# Altium schematic sheet External Connections.SchDoc
size A; SheetNumber: 3; SheetTotal: 4
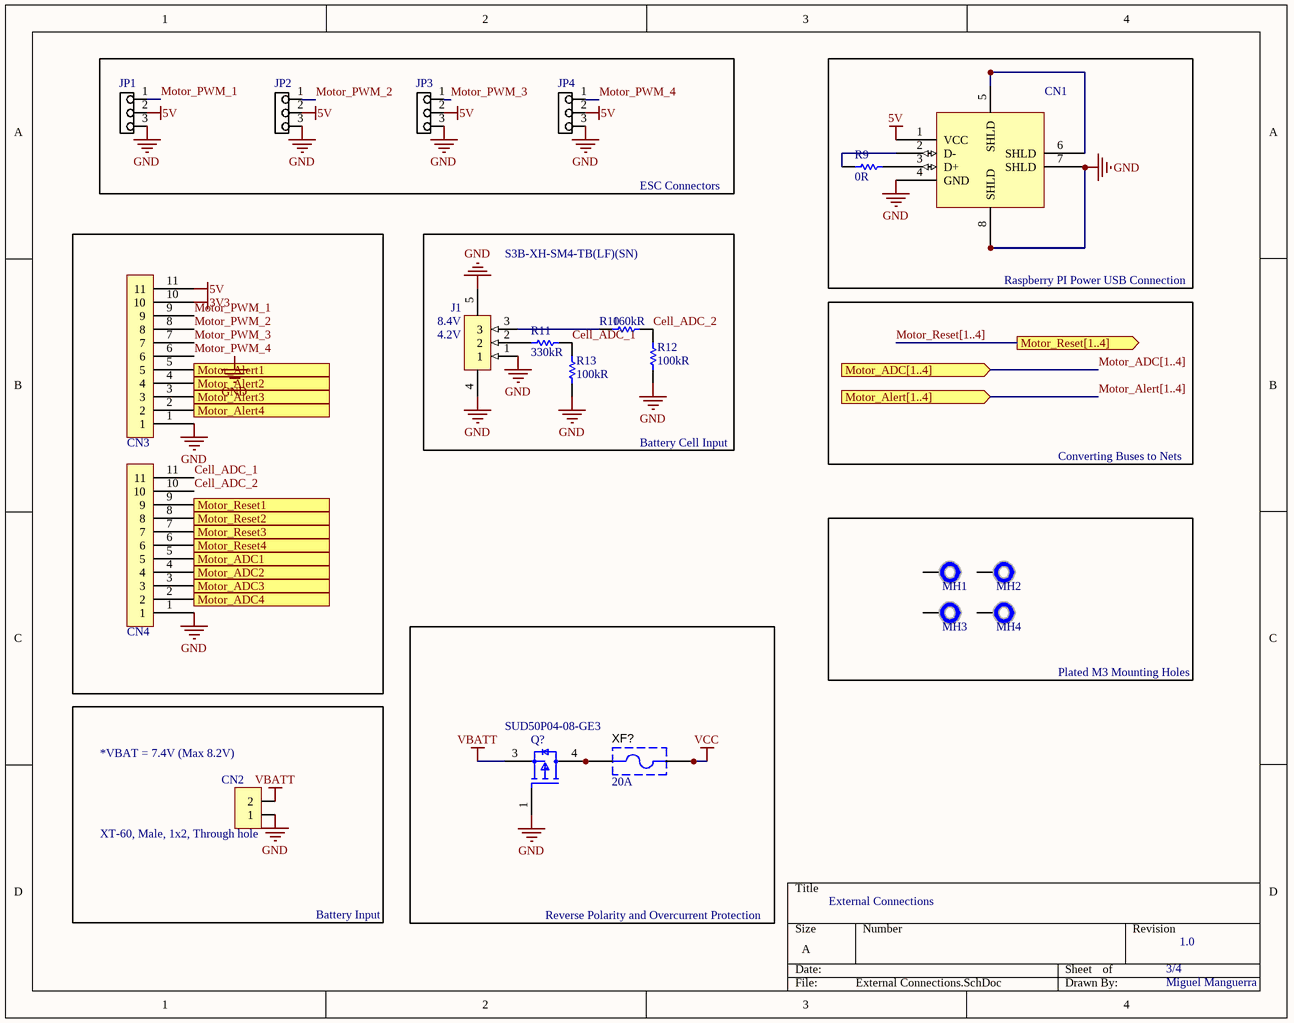
[diagram p0: External Connections.SchDoc]

## Parts
CN1  USB - Type A Female  [USB - Type A Female-Footprint-1]  (value not drawn)
CN2  XT-60, Male, 1x2, Through hole  [XT-60 Male]  (no BOM)
CN3  PH1-11-UA  [PH1-11-UA-Footprint-1]  (value not drawn)
CN4  PH1-11-UA  [PH1-11-UA-Footprint-1]  (value not drawn)
J1  S3B-XH-SM4-TB(LF)(SN)  [New footprint 1]
JP1  1x3 Male Jumper  [Header, Male, 1x3, Pitch: 0.1" (2.54mm),THT]  (value not drawn)
JP2  1x3 Male Jumper  [Header, Male, 1x3, Pitch: 0.1" (2.54mm),THT]  (value not drawn)
JP3  1x3 Male Jumper  [Header, Male, 1x3, Pitch: 0.1" (2.54mm),THT]  (value not drawn)
JP4  1x3 Male Jumper  [Header, Male, 1x3, Pitch: 0.1" (2.54mm),THT]  (value not drawn)
MH1  Mounting Hole, M3, Plated  [Clearance_M3_PLATED]  (value not drawn)  (no BOM)
MH2  Mounting Hole, M3, Plated  [Clearance_M3_PLATED]  (value not drawn)  (no BOM)
MH3  Mounting Hole, M3, Plated  [Clearance_M3_PLATED]  (value not drawn)  (no BOM)
MH4  Mounting Hole, M3, Plated  [Clearance_M3_PLATED]  (value not drawn)  (no BOM)
Q?  SUD50P04-08-GE3  [FP-T16-0236-MFG]
R9  value 0R  [RESC1608N(0603")]  (hidden comment: 0R, 1%, 1/10W, 0603 SMD)
R10  Resistance: 160kR  [RESC0603(1608)_M]  (hidden comment: RC0603FR-07160KL)
R11  Resistance: 330kR  [RESC0603(1608)_M]  (hidden comment: RMCF0603FT330K)
R12  Resistance: 100kR  [RESC1609X50X30ML10T20]  (hidden comment: CRCW0603-100KFKEA)
R13  Resistance: 100kR  [RESC1609X50X30ML10T20]  (hidden comment: CRCW0603-100KFKEA)
XF?  Current Rating: 20A  [KSTN-3557-2]  (hidden comment: 3557-2)

## Blocks framed on the sheet
ESC Connectors: JP1-JP4
Raspberry PI Power USB Connection: CN1 R9
Plated M3 Mounting Holes: MH1-MH4
Reverse Polarity and Overcurrent Protection: Q? XF?

## Ports
Motor_ADC1 (in), Motor_ADC2 (in), Motor_ADC3 (in), Motor_ADC4 (in), Motor_ADC[1..4] (in), Motor_Alert1 (in), Motor_Alert2 (in), Motor_Alert3 (in), Motor_Alert4 (in), Motor_Alert[1..4] (in), Motor_Reset1 (out), Motor_Reset2 (out), Motor_Reset3 (out), Motor_Reset4 (out), Motor_Reset[1..4] (out)

## Nets
3V3: CN3.10
5V: CN1.1(VCC) CN3.11 JP1.2 JP2.2 JP3.2 JP4.2
GND: CN1.4(GND) CN1.7(SHLD) CN1.8(SHLD) CN2.1 CN3.1 CN4.1 J1.1 J1.4 J1.5 JP1.3 JP2.3 JP3.3 JP4.3 Q?.1(G) R12.1 R13.1
VBATT: CN2.2 Q?.3(S)
VCC: XF?.3 XF?.4
Cell_ADC_1: CN4.11 R11.1 R13.2
Cell_ADC_2: CN4.10 R10.2 R12.2
Motor_ADC1: CN4.5 ; port Motor_ADC1
Motor_ADC2: CN4.4 ; port Motor_ADC2
Motor_ADC3: CN4.3 ; port Motor_ADC3
Motor_ADC4: CN4.2 ; port Motor_ADC4
Motor_Alert1: CN3.5 ; port Motor_Alert1
Motor_Alert2: CN3.4 ; port Motor_Alert2
Motor_Alert3: CN3.3 ; port Motor_Alert3
Motor_Alert4: CN3.2 ; port Motor_Alert4
Motor_PWM_1: CN3.9 JP1.1
Motor_PWM_2: CN3.8 JP2.1
Motor_PWM_3: CN3.7 JP3.1
Motor_PWM_4: CN3.6 JP4.1
Motor_Reset1: CN4.9 ; port Motor_Reset1
Motor_Reset2: CN4.8 ; port Motor_Reset2
Motor_Reset3: CN4.7 ; port Motor_Reset3
Motor_Reset4: CN4.6 ; port Motor_Reset4
NetCN1_2: CN1.2(D-) R9.1
NetCN1_3: CN1.3(D+) R9.2
NetCN1_5: CN1.5(SHLD) CN1.6(SHLD)
NetJ1_2: J1.2 R11.2
NetJ1_3: J1.3 R10.1
NetQ?_4: Q?.4(D) XF?.1 XF?.2

Not connected (* = marked no-connect by the designer): MH1 1; MH2 1; MH3 1; MH4 1

## Buses and harness runs
bus Motor_ADC[1..4] = port Motor_ADC[1..4]
bus Motor_Alert[1..4] = port Motor_Alert[1..4]
bus Motor_Reset[1..4] = port Motor_Reset[1..4]

## Notes on the sheet
- (near J1) 8.4V
- (near J1) 4.2V
- Battery Cell Input
- Converting Buses to Nets
- (near CN2) *VBAT = 7.4V (Max 8.2V)
- External Connections
- Battery Input
- 3/4
- 1.0
- Miguel Manguerra
- Labels drawn without touching a wire or pin: GND

## Library data of the parts
CN1 = CMP-00116-2: USB - Type A Female USB 2.0 THT; LCSC Part #: C168725; Created By: Miguel Manguerra
CN2 = CMP-005-0041-1: Date Published: 2016-09-08; Pin Count: 2; Source: AUVic_Schematic_Library_Connectors.SchLib; Component Type: Standard (No BOM); Design Item ID: XT-60, Male, 1x2, Through hole; Publisher: Andy Bates
CN3 CN4 = CMP-00135-1: Connector Header Through Hole 11 position 0.100" (2.54mm)
J1 = CMP-00132-1: JST (JAPAN SOLDERLESS TERMINALS) - S3B-XH-SM4-TB(LF)(SN) - Wire-To-Board Connector, XH Series, Surface Mount, Header, 3, 2.5 mm, Tin Plated Contacts RoHS Compliant: Yes; Number of Positions: 3; Pitch: 2.5mm; Contact Resistance: 20mR; Connector Type: Male Pin; Max Voltage Rating (AC): 250V; Max Current Rating: 3A; Gender: Male; Packaging: Tape and Reel; Number of Rows: 1; Length: 12.5mm; Number of Contacts: 3; Lead Free: Lead Free; Mount: Surface Mount; Contact Type: Male Pin; Color: Natural; Contact Plating: Tin,Copper; Package Quantity: 1; Max Operating Temperature: 85°C; REACH SVHC: No SVHC; Min Operating Temperature: -25°C; Orientation: Right Angle; Housing Material: Polyamide; Termination: Solder; Contact Material: Copper Alloy,Brass; Series: XH; Depth: 10mm; Housing Color: Beige; Fastening Type: Detent
JP1-JP4 = CMP-004-0002-1: Made By: Poorna Chander Kalidas; Component Type: Standard; Design Item ID: 1x3 Male Jumper; Source: AUVic_Schematic_Library_Connectors.SchLib; Pin Count: 3
MH1-MH4 = CMP-053-0000-1: Created By: Ashwin Sira; Pin Count: 1; Publisher: AUVic; Date Created: 2016-06-08; Source: AUVic_Integrated_Library_Virtual_Components.SchLib; Design Item ID: Mounting Hole, M3, Plated; Component Type: Standard (No BOM)
Q? = CMP-02550-000229-1: MOSFET P-CH 40V 50A DPAK; Manufacturer: Vishay; Gate To Source Voltage: 20V; Transconductance: 45S; Gate Charge At Vgs: 106nC @ -10V; Threshold Vgs Max: -2.5V; Continuous Drain Current: -50A; Drain To Source Voltage: -40V; Reverse Recovery Time: 35ns; Max Forward Diode Voltage: -1.5V; Input Capacitace At Vds: 5380pF @ -20V; Number Of Channels: 1; Threshold Vgs Min: -1V; Pulse Drain Current: -100A; Max Junction Temp: +150°C; Drain To Source Resistance: 0.0067Ω; Turn On Delay Time: 15ns; Depletion Mode: False; Turn Off Delay Time: 70ns; Typ Forward Diode Voltage: -0.8V; Reverse Recovery Charge: 33nC; Power Dissipation: 2.5W; Rthja Max: 50°C/W; Digikey Description: MOSFET P-CH 40V 50A DPAK; Category: Trans; Package: T16-0236; Device Class L2: Transistors; Lead Free: Yes; Temperature Range High: +150°C; RoHS: TRUE; Manufacturer Part Number: SUD50P04-08-GE3; Drain To Source Breakdown Voltage: -40V; Temperature Range Low: -55°C; Device Class L1: Discrete Semiconductors; Number Of P Channels: 1; Height: 2.507mm; Device Class L3: MOSFETs; ComponentLink2URL: http://www.vishay.com/docs/65594/sud50p04-08.pdf; ComponentLink2Description: Datasheet; Mouser Description: p-Ch Mosfet Dpak (To-252) 40v 8.1mohm @ 10v; Automotive: No; Octopart: https://octopart.com/sud50p04-08-ge3-vishay-44145278; Temperature: -55°C to +150°C
R9 = CMP-047-0001-1: Made By: Ashwin Sira; Owned By: AUVic; Component Type: Standard; Design Item ID: 0R, 1%, 1/10W, 0603 SMD; Last Edited: 14-05-31; Created On: 14-05-31; Source: AUVic_Schematic_Library_Resistors.SchLib; Pin Count: 2
R10 = CMP-00134-1: RES SMD 160K OHM 1% 1/10W 0603; Voltage Rating: 50V; Temperature Coefficient: 100ppm/°C; Max Power Dissipation: 100mW; Mount: Surface Mount; Resistor Type: Thick Film; Packaging: Tape and Reel; Features: Moisture Resistant; Min Operating Temperature: -55°C; Width: 0.031inch; Size Code: 0603; Series: RC; Tolerance: 1%; Number of Terminations: 2; RoHS Compliant: Yes; Max Operating Temperature: 155°C; Termination: SMD/SMT; Height: 0.022inch; Case/Package: 0603; Package Quantity: 1; Military Standard: Not; Case Code (Imperial): 0603; Power Rating: 100mW; Depth: 0.8mm; Length: 0.063inch; Lead Free: Lead Free; Case Code (Metric): 1608; Construction: Rectangular; Voltage Rating (DC): 50V; Technology: THICK FILM
R11 = CMP-00133-1: RES 330K OHM 1% 1/10W 0603; Max Power Dissipation: 100mW; Temperature Coefficient: 100ppm/°C; Width: 0.031inch; RoHS Compliant: Yes; Tolerance: 1%; Max Operating Temperature: 155°C; Case Code (Metric): 1608; Contact Plating: Tin,Matte; Number of Terminations: 2; Series: RMCF; Features: Automotive AEC-Q200; Length: 0.061inch; Resistor Type: Thick Film; Packaging: Tape and Reel; Min Operating Temperature: -55°C; Case/Package: 0603; Case Code (Imperial): 0603; Height: 0.022inch; Mount: Surface Mount; Radiation Hardening: No
R12 R13 = CMP-00036-2: Resistor; Thick Film; 100 Kilohms; 0.1 W; 1%; SMT; 0603; TCR 37 ppm/DegC; Tape and Reel; Power Rating: 100mW; Voltage Rating (DC): 75V; Temperature Coefficient: 100ppm/°C; Width: 0.033inch; Contact Plating: Tin,Lead; Packaging: Tape and Reel; Termination: SMD/SMT; Number of Pins: 2; Package Quantity: 10; Radiation Hardening: No; Case Code (Imperial): 0603; Military Standard: Not; REACH SVHC: Unknown; Max Power Dissipation: 100mW; Tolerance: 1%; Weight: 7.1E-05oz; Length: 1.55mm; Number of Terminations: 2; Min Operating Temperature: -55°C; Lead Free: Lead Free; Max Operating Temperature: 155°C; Composition: Thick Film; Features: Automotive AEC-Q200; Case Code (Metric): 1608; Case/Package: 0603; Depth: 0.85mm; Height: 0.45mm; Voltage Rating: 75V
XF? = CMP-00030-4: Fuse Holder; Auto; 2 in1 Blade; THM; 1 Fuse; Vertical; 30 Amps; Number of Poles: 1; Fuse Type: Automotive; Voltage: 500V; Illumination Type: Illuminated; Lead Free: Lead Free; REACH SVHC: No SVHC; Package Quantity: 1; Contact Material: Brass; Length: 19.8mm; Fuse Current: 20A; Flammability Rating: UL94 V-0; Mount: Vertical,PCB; Min Operating Temperature: -50°C; Color: Black; Termination: PC Pin; Max Operating Temperature: 145°C; Voltage Rating (AC): 500V; Number of Circuits: 1; Contact Plating: Tin; Orientation: Vertical; Material: Brass,Tin,Nylon; Depth: 6.8mm